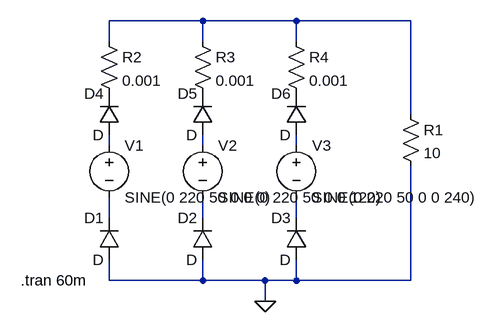
[diagram p0: schematic 3phasediodefullwave.asc]
3phasediodefullwave.asc, the LTspice schematic file:
Version 4
SHEET 1 880 680
WIRE 0 144 -144 144
WIRE 144 144 0 144
WIRE 320 144 144 144
WIRE -144 176 -144 144
WIRE 0 176 0 144
WIRE 144 176 144 144
WIRE 320 288 320 144
WIRE -144 336 -144 320
WIRE 0 336 0 320
WIRE 144 336 144 320
WIRE -144 448 -144 416
WIRE 0 448 0 416
WIRE 144 448 144 416
WIRE -144 544 -144 512
WIRE 0 544 0 512
WIRE 0 544 -144 544
WIRE 96 544 0 544
WIRE 144 544 144 512
WIRE 144 544 96 544
WIRE 320 544 320 368
WIRE 320 544 144 544
WIRE 96 576 96 544
FLAG 96 576 0
SYMBOL voltage -144 320 R0
SYMATTR InstName V1
SYMATTR Value SINE(0 220 50 0 0 0)
SYMBOL voltage 0 320 R0
SYMATTR InstName V2
SYMATTR Value SINE(0 220 50 0 0 120)
SYMBOL voltage 144 320 R0
SYMATTR InstName V3
SYMATTR Value SINE(0 220 50 0 0 240)
SYMBOL res 304 272 R0
SYMATTR InstName R1
SYMATTR Value 10
SYMBOL res -160 160 R0
SYMATTR InstName R2
SYMATTR Value 0.001
SYMBOL res -16 160 R0
SYMATTR InstName R3
SYMATTR Value 0.001
SYMBOL res 128 160 R0
SYMATTR InstName R4
SYMATTR Value 0.001
SYMBOL diode -128 512 R180
WINDOW 0 24 64 Left 2
WINDOW 3 24 0 Left 2
SYMATTR InstName D1
SYMBOL diode 16 512 R180
WINDOW 0 24 64 Left 2
WINDOW 3 24 0 Left 2
SYMATTR InstName D2
SYMBOL diode 160 512 R180
WINDOW 0 24 64 Left 2
WINDOW 3 24 0 Left 2
SYMATTR InstName D3
SYMBOL diode -128 320 R180
WINDOW 0 24 64 Left 2
WINDOW 3 24 0 Left 2
SYMATTR InstName D4
SYMBOL diode 16 320 R180
WINDOW 0 24 64 Left 2
WINDOW 3 24 0 Left 2
SYMATTR InstName D5
SYMBOL diode 160 320 R180
WINDOW 0 24 64 Left 2
WINDOW 3 24 0 Left 2
SYMATTR InstName D6
TEXT -280 544 Left 2 !.tran 60m

The netlist it stands for:
* 3phasediodefullwave.asc
V1 N002 N005 SINE(0 220 50 0 0 0)
V2 N003 N006 SINE(0 220 50 0 0 120)
V3 N004 N007 SINE(0 220 50 0 0 240)
R1 N001 0 10
R2 N001 P001 0.001
R3 N001 P002 0.001
R4 N001 P003 0.001
D1 0 N005 D
D2 0 N006 D
D3 0 N007 D
D4 N002 P001 D
D5 N003 P002 D
D6 N004 P003 D
.model D D
.lib standard.dio
.tran 60m
.backanno
.end